# Altium schematic sheet channel_3.SchDoc
size A; SheetNumber: 11; SheetTotal: 12
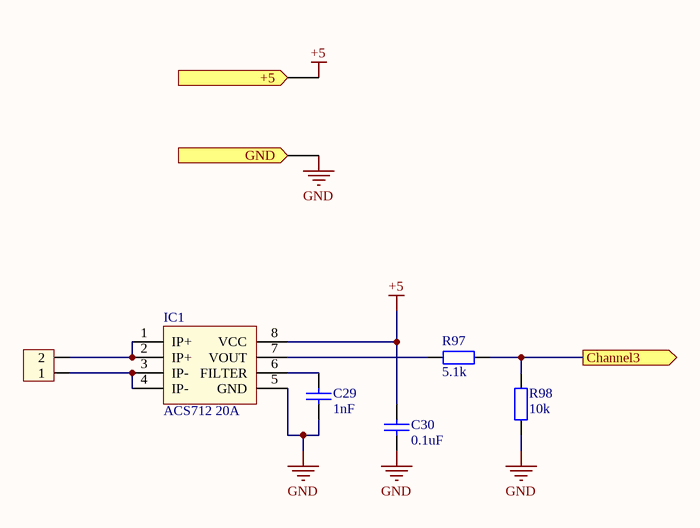
[diagram p0: channel_3.SchDoc]

## Parts
C29  1nF  [tu 0603]
C30  0.1uF  [tu 0603]
H3  Header 2P 2.54 Duc Thang  [15EDGR-3.81-2P]  (value not drawn)
IC1  ACS712 20A  [sop8]
R97  5.1k  [tro smd 0805]
R98  10k  [tro smd 0805]

## Ports
+5 (in), Channel3 (out), GND (in)

## Nets
+5: C30.1 IC1.8(VCC) ; port +5
GND: C29.2 C30.2 IC1.5(GND) R98.1 ; port GND
Channel3: R97.2 R98.2 ; port Channel3
NetC29_1: C29.1 IC1.6(FILTER)
NetH3_1: H3.1 IC1.3(IP-) IC1.4(IP-)
NetH3_2: H3.2 IC1.1(IP+) IC1.2(IP+)
NetIC1_7: IC1.7(VOUT) R97.1

## Library data of the parts
C29 C30 = Tu 0603 105 16V 20%: Dán; Don_Vi: Con; So_Chan: 2; Ten_Linh_Kien: Tụ 0603 105-1uF 20% 16V; Ma_Hang: MH004574; Chung_Loai: Dán; Kieu_Chan: *
H3 = Header 2P 2.54 Duc Thang: Cắm; Ten_Linh_Kien: Header 2P XH2.54-2P Đực Thẳng; Don_Vi: Con; Ma_Hang: MH001283; Chung_Loai: Cắm
IC1 = ACS712: Cắm; Ten_Linh_Kien: AT24C01 DIP8 EEPROM 1KBIT; Ma_Hang: MH002775; Don_Vi: Con; Kieu_Chan: *; Ghi_Chu: *; Chung_Loai: Cắm
R97 R98 = Tro 0603 1% 10k: Dán; Don_Vi: Con; So_Chan: 2; Ten_Linh_Kien: Trở 0603 1% 10k; Ma_Hang: MH006333; Chung_Loai: Dán; Kieu_Chan: *